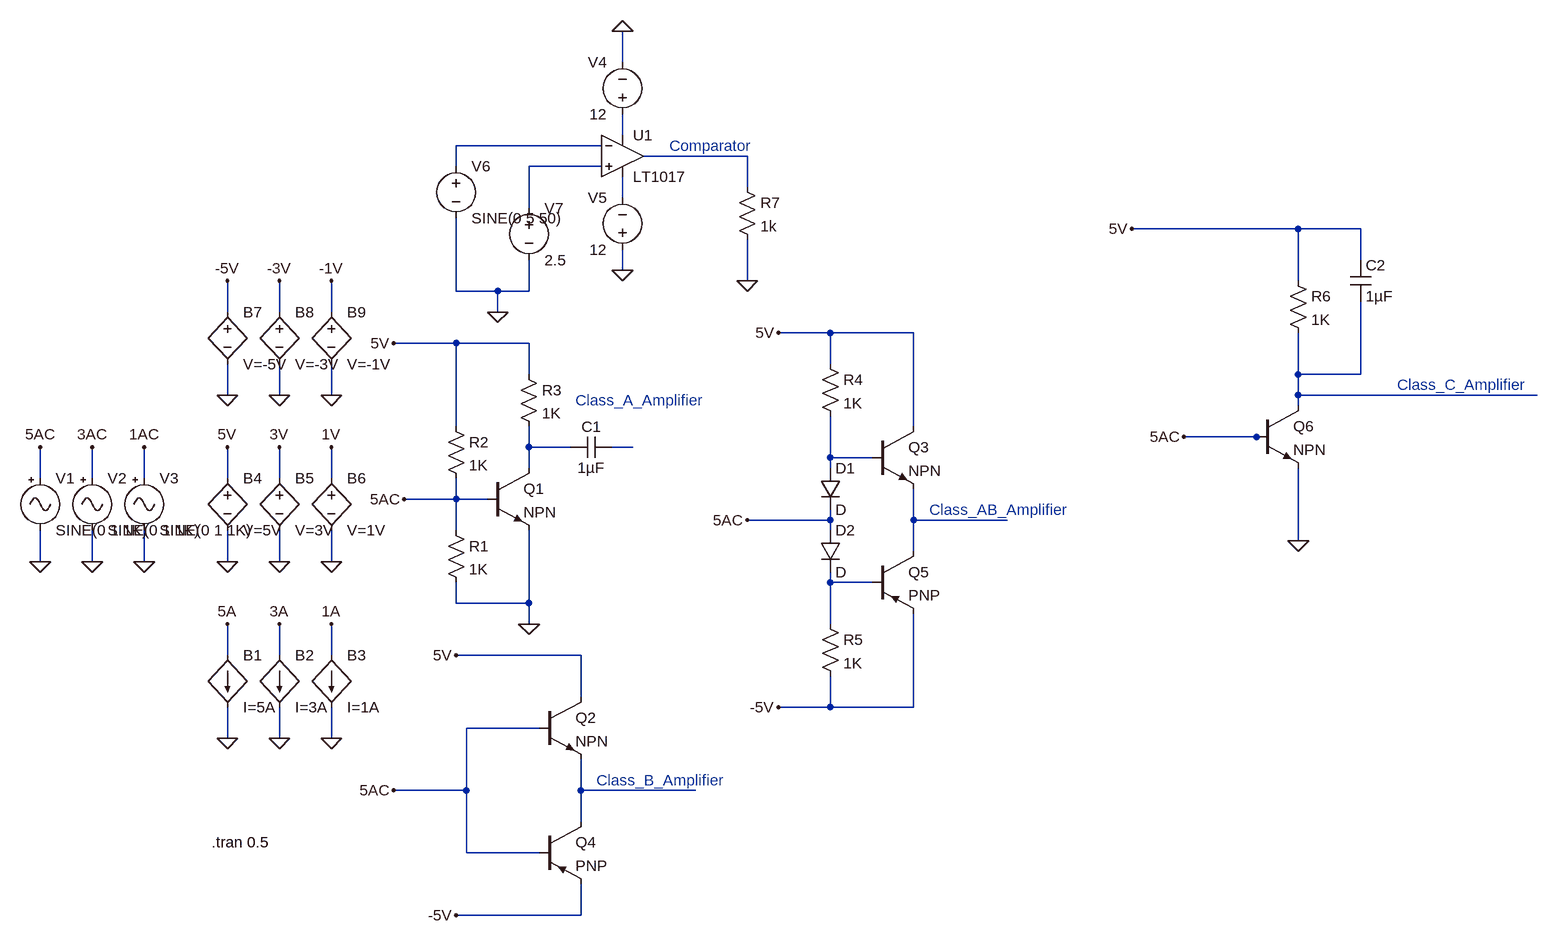
[diagram p0: schematic Class_F.asc]
Class_F.asc, the LTspice schematic file:
Version 4
SHEET 1 1940 748
WIRE 528 -720 528 -768
WIRE 528 -608 528 -640
WIRE 496 -592 272 -592
WIRE 720 -576 560 -576
WIRE 272 -560 272 -592
WIRE 496 -560 384 -560
WIRE 720 -528 720 -576
WIRE 528 -512 528 -544
WIRE 384 -496 384 -560
WIRE 1568 -464 1312 -464
WIRE 1664 -464 1568 -464
WIRE 1664 -416 1664 -464
WIRE 528 -400 528 -432
WIRE 720 -384 720 -448
WIRE 1568 -384 1568 -464
WIRE 272 -368 272 -480
WIRE 336 -368 272 -368
WIRE 384 -368 384 -416
WIRE 384 -368 336 -368
WIRE -80 -336 -80 -384
WIRE 0 -336 0 -384
WIRE 80 -336 80 -384
WIRE 336 -336 336 -368
WIRE 848 -304 768 -304
WIRE 976 -304 848 -304
WIRE 272 -288 176 -288
WIRE 384 -288 272 -288
WIRE 848 -256 848 -304
WIRE 384 -240 384 -288
WIRE 1568 -240 1568 -304
WIRE 1664 -240 1664 -352
WIRE 1664 -240 1568 -240
WIRE -80 -208 -80 -256
WIRE 0 -208 0 -256
WIRE 80 -208 80 -256
WIRE 1568 -208 1568 -240
WIRE 1936 -208 1568 -208
WIRE 1568 -192 1568 -208
WIRE 272 -160 272 -288
WIRE 976 -160 976 -304
WIRE 1504 -144 1392 -144
WIRE 1520 -144 1504 -144
WIRE 384 -128 384 -160
WIRE 448 -128 384 -128
WIRE 544 -128 512 -128
WIRE 848 -112 848 -176
WIRE 912 -112 848 -112
WIRE 384 -96 384 -128
WIRE 848 -96 848 -112
WIRE -368 -80 -368 -128
WIRE -288 -80 -288 -128
WIRE -208 -80 -208 -128
WIRE -80 -80 -80 -128
WIRE 0 -80 0 -128
WIRE 80 -80 80 -128
WIRE 272 -48 272 -80
WIRE 272 -48 192 -48
WIRE 320 -48 272 -48
WIRE 848 -16 848 -32
WIRE 848 -16 720 -16
WIRE 976 -16 976 -64
WIRE 1120 -16 976 -16
WIRE 272 0 272 -48
WIRE 848 0 848 -16
WIRE 1568 16 1568 -96
WIRE 976 32 976 -16
WIRE -368 48 -368 0
WIRE -288 48 -288 0
WIRE -208 48 -208 0
WIRE -80 48 -80 0
WIRE 0 48 0 0
WIRE 80 48 80 0
WIRE 848 80 848 64
WIRE 912 80 848 80
WIRE 272 112 272 80
WIRE 384 112 384 0
WIRE 384 112 272 112
WIRE 384 144 384 112
WIRE 848 144 848 80
WIRE -80 192 -80 144
WIRE 0 192 0 144
WIRE 80 192 80 144
WIRE 464 192 272 192
WIRE 464 256 464 192
WIRE 848 272 848 224
WIRE 848 272 768 272
WIRE 976 272 976 128
WIRE 976 272 848 272
WIRE 400 304 288 304
WIRE -80 320 -80 272
WIRE 0 320 0 272
WIRE 80 320 80 272
WIRE 288 400 288 304
WIRE 288 400 176 400
WIRE 464 400 464 352
WIRE 640 400 464 400
WIRE 464 448 464 400
WIRE 288 496 288 400
WIRE 400 496 288 496
WIRE 464 592 464 544
WIRE 464 592 272 592
FLAG -80 48 0
FLAG 0 48 0
FLAG 80 48 0
FLAG -80 -128 5V
FLAG 0 -128 3V
FLAG 80 -128 1V
FLAG -80 320 0
FLAG 0 320 0
FLAG 80 320 0
FLAG -80 144 5A
FLAG 0 144 3A
FLAG 80 144 1A
FLAG -368 48 0
FLAG -288 48 0
FLAG -208 48 0
FLAG -368 -128 5AC
FLAG -288 -128 3AC
FLAG -208 -128 1AC
FLAG 384 144 0
FLAG 192 -48 5AC
FLAG 176 -288 5V
FLAG 176 400 5AC
FLAG 272 192 5V
FLAG 272 592 -5V
FLAG -80 -208 0
FLAG 0 -208 0
FLAG 80 -208 0
FLAG -80 -384 -5V
FLAG 0 -384 -3V
FLAG 80 -384 -1V
FLAG 720 -16 5AC
FLAG 768 -304 5V
FLAG 768 272 -5V
FLAG 1568 16 0
FLAG 1392 -144 5AC
FLAG 1312 -464 5V
FLAG 720 -384 0
FLAG 528 -400 0
FLAG 528 -768 0
FLAG 336 -336 0
SYMBOL bi -80 192 R0
SYMATTR InstName B1
SYMATTR Value I=5A
SYMBOL bi 0 192 R0
SYMATTR InstName B2
SYMATTR Value I=3A
SYMBOL bi 80 192 R0
SYMATTR InstName B3
SYMATTR Value I=1A
SYMBOL bv -80 -96 R0
SYMATTR InstName B4
SYMATTR Value V=5V
SYMBOL bv 0 -96 R0
SYMATTR InstName B5
SYMATTR Value V=3V
SYMBOL bv 80 -96 R0
SYMATTR InstName B6
SYMATTR Value V=1V
SYMBOL npn 320 -96 R0
SYMATTR InstName Q1
SYMBOL npn 400 256 R0
SYMATTR InstName Q2
SYMBOL npn 912 -160 R0
SYMATTR InstName Q3
SYMBOL pnp 400 448 R0
SYMATTR InstName Q4
SYMBOL pnp 912 32 R0
SYMATTR InstName Q5
SYMBOL npn 1504 -192 R0
SYMATTR InstName Q6
SYMBOL res 256 -16 R0
SYMATTR InstName R1
SYMATTR Value 1K
SYMBOL res 256 -176 R0
SYMATTR InstName R2
SYMATTR Value 1K
SYMBOL res 368 -256 R0
SYMATTR InstName R3
SYMATTR Value 1K
SYMBOL cap 512 -144 R90
WINDOW 0 0 32 VBottom 2
WINDOW 3 32 32 VTop 2
SYMATTR InstName C1
SYMATTR Value 1µF
SYMBOL Misc\\signal -368 -96 R0
SYMATTR InstName V1
SYMBOL Misc\\signal -288 -96 R0
SYMATTR InstName V2
SYMBOL Misc\\signal -208 -96 R0
SYMATTR InstName V3
SYMBOL bv -80 -352 R0
SYMATTR InstName B7
SYMATTR Value V=-5V
SYMBOL bv 0 -352 R0
SYMATTR InstName B8
SYMATTR Value V=-3V
SYMBOL bv 80 -352 R0
SYMATTR InstName B9
SYMATTR Value V=-1V
SYMBOL res 832 -272 R0
SYMATTR InstName R4
SYMATTR Value 1K
SYMBOL res 832 128 R0
SYMATTR InstName R5
SYMATTR Value 1K
SYMBOL diode 832 -96 R0
SYMATTR InstName D1
SYMBOL diode 832 0 R0
SYMATTR InstName D2
SYMBOL res 1552 -400 R0
SYMATTR InstName R6
SYMATTR Value 1K
SYMBOL cap 1648 -416 R0
SYMATTR InstName C2
SYMATTR Value 1µF
SYMBOL Comparators\\LT1017 528 -576 R0
SYMATTR InstName U1
SYMBOL voltage 528 -624 R180
WINDOW 0 24 96 Left 2
WINDOW 3 24 16 Left 2
SYMATTR InstName V4
SYMATTR Value 12
SYMBOL voltage 528 -416 R180
WINDOW 0 24 96 Left 2
WINDOW 3 24 16 Left 2
SYMATTR InstName V5
SYMATTR Value 12
SYMBOL voltage 272 -576 R0
WINDOW 123 0 0 Left 0
WINDOW 39 0 0 Left 0
SYMATTR InstName V6
SYMATTR Value SINE(0 5 50)
SYMBOL voltage 384 -512 R0
SYMATTR InstName V7
SYMATTR Value 2.5
SYMBOL res 704 -544 R0
SYMATTR InstName R7
SYMATTR Value 1k
TEXT -104 480 Left 2 !.tran 0.5
TEXT 456 -200 Left 2 ;Class_A_Amplifier
TEXT 488 384 Left 2 ;Class_B_Amplifier
TEXT 1000 -32 Left 2 ;Class_AB_Amplifier
TEXT 1720 -224 Left 2 ;Class_C_Amplifier
TEXT 600 -592 Left 2 ;Comparator

The netlist it stands for:
* Class_F.asc
B1 5A 0 I=5A
B2 3A 0 I=3A
B3 1A 0 I=1A
B4 5V 0 V=5V
B5 3V 0 V=3V
B6 1V 0 V=1V
Q1 N007 5AC 0 0 NPN
Q2 5V 5AC N012 0 NPN
Q3 5V N009 N010 0 NPN
Q4 N012 5AC -5V 0 PNP
Q5 N010 N011 -5V 0 PNP
Q6 N006 5AC 0 0 NPN
R1 5AC 0 1K
R2 5V 5AC 1K
R3 5V N007 1K
C1 N008 N007 1µF
V1 5AC 0 SINE(0 1 1K)
V2 3AC 0 SINE(0 1 1K)
V3 1AC 0 SINE(0 1 1K)
B7 -5V 0 V=-5V
B8 -3V 0 V=-3V
B9 -1V 0 V=-1V
R4 5V N009 1K
R5 N011 -5V 1K
D1 N009 5AC D
D2 5AC N011 D
R6 5V N006 1K
C2 5V N006 1µF
XU1 N004 N002 N001 N005 N003 LT1017  ; pins In+ In- V+ V- OUT
V4 N001 0 12
V5 0 N005 12
V6 N002 0 SINE(0 5 50)
V7 N004 0 2.5
R7 N003 0 1k
.model D D
.lib standard.dio
.model NPN NPN
.model PNP PNP
.lib standard.bjt
.tran 0.5
* Class_A_Amplifier
* Class_B_Amplifier
* Class_AB_Amplifier
* Class_C_Amplifier
* Comparator
.backanno
.end